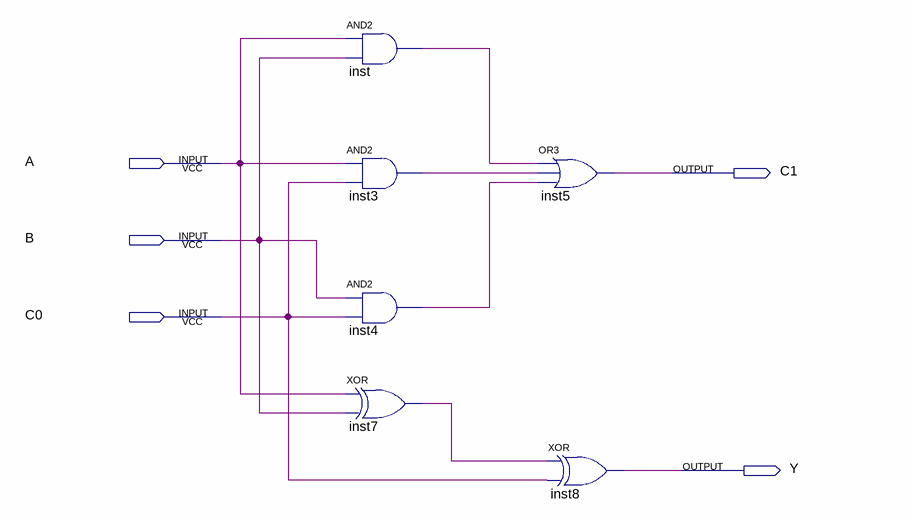
[diagram p0: schematic sheet]
// Quartus schematic adder2.bdf as structural Verilog: 6 symbols, 5 pins
module adder2 (
  input  A,
  input  B,
  input  C0,
  output C1,
  output Y
);

  wire inst3_out, inst4_out, inst7_out, inst_out;

  and inst (inst_out, A, B);
  and inst3 (inst3_out, A, C0);
  and inst4 (inst4_out, B, C0);
  xor inst7 (inst7_out, A, B);
  or inst5 (C1, inst_out, inst3_out, inst4_out);
  xor inst8 (Y, inst7_out, C0);
endmodule
